# Altium project engine-control-unit.PrjPcb
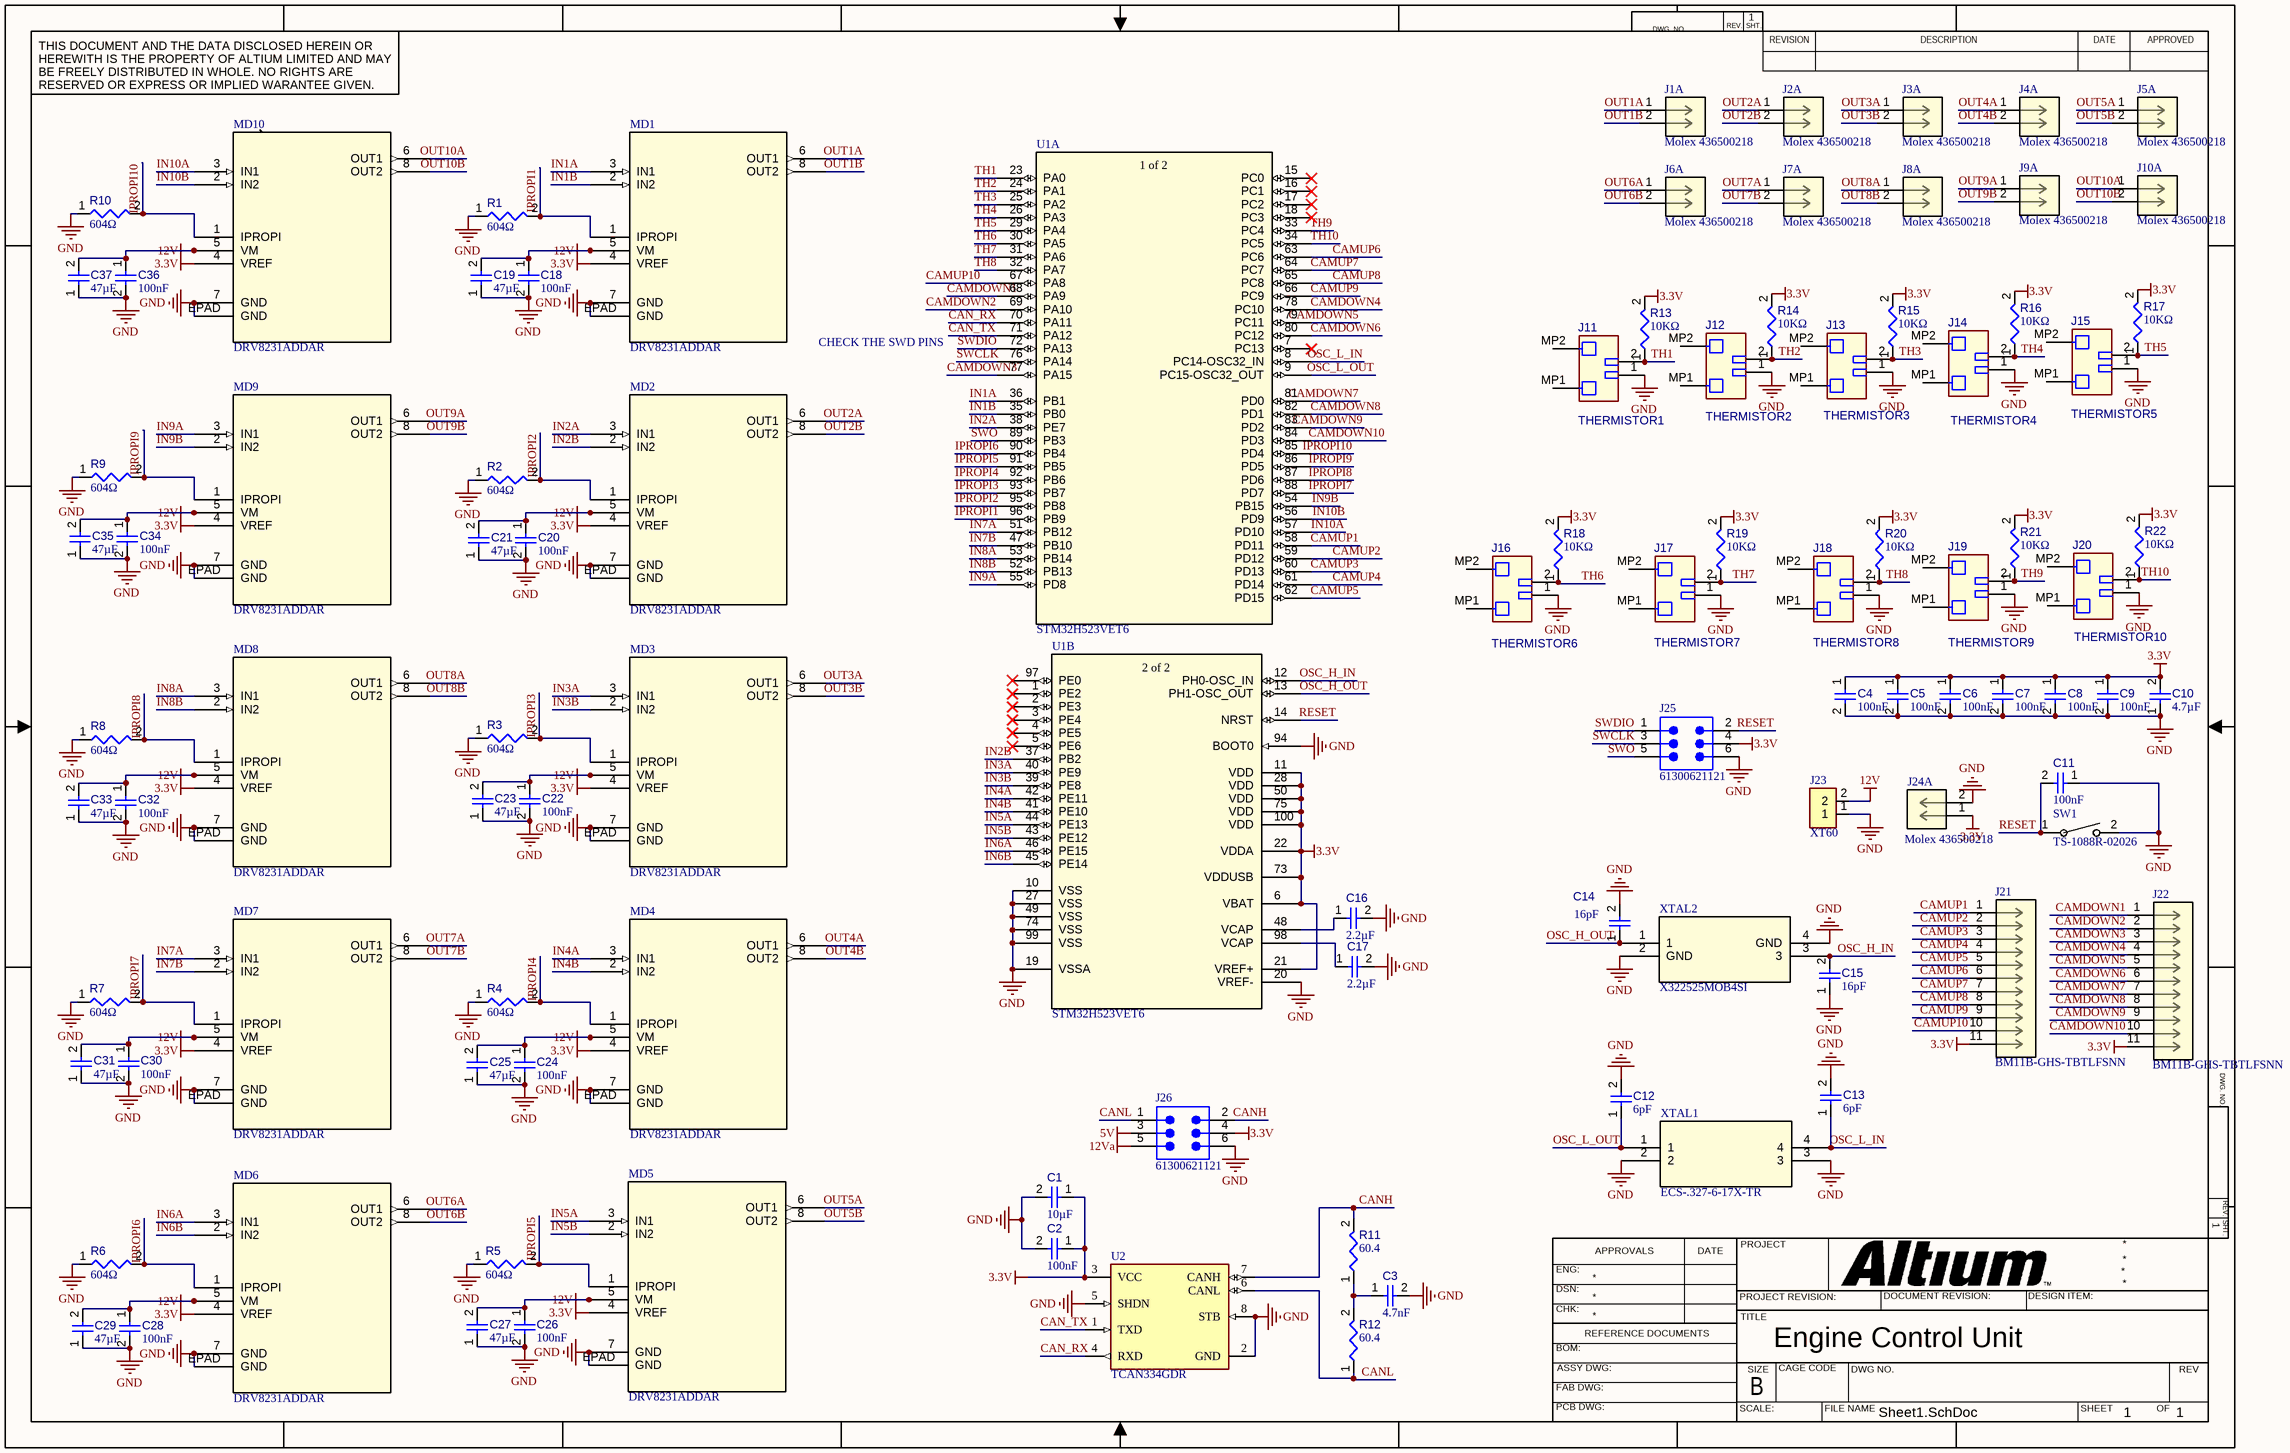
[diagram p0: Sheet1.SchDoc]
1 sheet, 100 parts. Net scope: global (net labels, ports and power ports of the same name join across sheets).
Board file: PCB1.PcbDoc

## Sheet Sheet1.SchDoc: Engine Control Unit
size 431 x 279 mm; Date: June 27, 2025; Author: Jaylen Cheung; Revision: A; SheetNumber: 1; SheetTotal: 1

### Parts
C1  value 10µF  [CAPC0805(2012)145_L]  (hidden comment: Capacitor 10µF +/-20% 25V 0805)
C2  value 100nF  [CAPC0402(1005)60_L]  (hidden comment: Capacitor 100nF +/-20% 50V 0402)
C3  value 4.7nF  [CAPC1709X04N]  (hidden comment: yageo CC0603KRX7R9BB472)
C4  value 100nF  [CAPC0402(1005)60_L]  (hidden comment: Capacitor 100nF +/-20% 50V 0402)
C5  value 100nF  [CAPC0402(1005)60_L]  (hidden comment: Capacitor 100nF +/-20% 50V 0402)
C6  value 100nF  [CAPC0402(1005)60_L]  (hidden comment: Capacitor 100nF +/-20% 50V 0402)
C7  value 100nF  [CAPC0402(1005)60_L]  (hidden comment: Capacitor 100nF +/-20% 50V 0402)
C8  value 100nF  [CAPC0402(1005)60_L]  (hidden comment: Capacitor 100nF +/-20% 50V 0402)
C9  value 100nF  [CAPC0402(1005)60_L]  (hidden comment: Capacitor 100nF +/-20% 50V 0402)
C10  value 4.7µF  [CAPC0603(1608)100_L]  (hidden comment: Capacitor 4.7µF +/-20% 10V 0603)
C11  value 100nF  [CAPC0402(1005)60_L]  (hidden comment: Capacitor 100nF +/-20% 50V 0402)
C12  value 6pF  [CAPC1709X04N]  (hidden comment: Yageo CC0603CRNPO9BN6R0)
C13  value 6pF  [CAPC1709X04N]  (hidden comment: Yageo CC0603CRNPO9BN6R0)
C14  value 16pF  [CAPC1709X04N]  (hidden comment: Yageo CC0603JRNPO9BN160)
C15  value 16pF  [CAPC1709X04N]  (hidden comment: Yageo CC0603JRNPO9BN160)
C16  value 2.2µF  [CAPC1709X04N]  (hidden comment: yageo CC0603KRX5R8BB225)
C17  value 2.2µF  [CAPC1709X04N]  (hidden comment: yageo CC0603KRX5R8BB225)
C18  value 100nF  [CAPC0402(1005)60_L]  (hidden comment: Capacitor 100nF +/-20% 50V 0402)
C19  value 47µF  [N18F1D473MQ0T0S0N0-Footprint-1]  (hidden comment: N18F1D473MQ0T0S0N0)
C20  value 100nF  [CAPC0402(1005)60_L]  (hidden comment: Capacitor 100nF +/-20% 50V 0402)
C21  value 47µF  [N18F1D473MQ0T0S0N0-Footprint-1]  (hidden comment: N18F1D473MQ0T0S0N0)
C22  value 100nF  [CAPC0402(1005)60_L]  (hidden comment: Capacitor 100nF +/-20% 50V 0402)
C23  value 47µF  [N18F1D473MQ0T0S0N0-Footprint-1]  (hidden comment: N18F1D473MQ0T0S0N0)
C24  value 100nF  [CAPC0402(1005)60_L]  (hidden comment: Capacitor 100nF +/-20% 50V 0402)
C25  value 47µF  [N18F1D473MQ0T0S0N0-Footprint-1]  (hidden comment: N18F1D473MQ0T0S0N0)
C26  value 100nF  [CAPC0402(1005)60_L]  (hidden comment: Capacitor 100nF +/-20% 50V 0402)
C27  value 47µF  [N18F1D473MQ0T0S0N0-Footprint-1]  (hidden comment: N18F1D473MQ0T0S0N0)
C28  value 100nF  [CAPC0402(1005)60_L]  (hidden comment: Capacitor 100nF +/-20% 50V 0402)
C29  value 47µF  [N18F1D473MQ0T0S0N0-Footprint-1]  (hidden comment: N18F1D473MQ0T0S0N0)
C30  value 100nF  [CAPC0402(1005)60_L]  (hidden comment: Capacitor 100nF +/-20% 50V 0402)
C31  value 47µF  [N18F1D473MQ0T0S0N0-Footprint-1]  (hidden comment: N18F1D473MQ0T0S0N0)
C32  value 100nF  [CAPC0402(1005)60_L]  (hidden comment: Capacitor 100nF +/-20% 50V 0402)
C33  value 47µF  [N18F1D473MQ0T0S0N0-Footprint-1]  (hidden comment: N18F1D473MQ0T0S0N0)
C34  value 100nF  [CAPC0402(1005)60_L]  (hidden comment: Capacitor 100nF +/-20% 50V 0402)
C35  value 47µF  [N18F1D473MQ0T0S0N0-Footprint-1]  (hidden comment: N18F1D473MQ0T0S0N0)
C36  value 100nF  [CAPC0402(1005)60_L]  (hidden comment: Capacitor 100nF +/-20% 50V 0402)
C37  value 47µF  [N18F1D473MQ0T0S0N0-Footprint-1]  (hidden comment: N18F1D473MQ0T0S0N0)
J1  Molex 436500218  [CONN_SD-43650-007_02_MOL]  (part A of 2)
J2  Molex 436500218  [CONN_SD-43650-007_02_MOL]  (part A of 2)
J3  Molex 436500218  [CONN_SD-43650-007_02_MOL]  (part A of 2)
J4  Molex 436500218  [CONN_SD-43650-007_02_MOL]  (part A of 2)
J5  Molex 436500218  [CONN_SD-43650-007_02_MOL]  (part A of 2)
J6  Molex 436500218  [CONN_SD-43650-007_02_MOL]  (part A of 2)
J7  Molex 436500218  [CONN_SD-43650-007_02_MOL]  (part A of 2)
J8  Molex 436500218  [CONN_SD-43650-007_02_MOL]  (part A of 2)
J9  Molex 436500218  [CONN_SD-43650-007_02_MOL]  (part A of 2)
J10  Molex 436500218  [CONN_SD-43650-007_02_MOL]  (part A of 2)
J11  THERMISTOR1  [JST-BM02B-GHS-TBT_V]
J12  THERMISTOR2  [JST-BM02B-GHS-TBT_V]
J13  THERMISTOR3  [JST-BM02B-GHS-TBT_V]
J14  THERMISTOR4  [JST-BM02B-GHS-TBT_V]
J15  THERMISTOR5  [JST-BM02B-GHS-TBT_V]
J16  THERMISTOR6  [JST-BM02B-GHS-TBT_V]
J17  THERMISTOR7  [JST-BM02B-GHS-TBT_V]
J18  THERMISTOR8  [JST-BM02B-GHS-TBT_V]
J19  THERMISTOR9  [JST-BM02B-GHS-TBT_V]
J20  THERMISTOR10  [JST-BM02B-GHS-TBT_V]
J21  BM11B-GHS-TBTLFSNN  [CONN11_BM11B-GHS-TBTLFSNN_JST]
J22  BM11B-GHS-TBTLFSNN  [CONN11_BM11B-GHS-TBTLFSNN_JST]
J23  XT60  [AMASS_XT60PB-M]
J24  Molex 436500218  [CONN_SD-43650-007_02_MOL]  (part A of 2)
J25  61300621121  [61300621121]
J26  61300621121  [61300621121]
MD1  DRV8231ADDAR  [SOIC-8-DDA-DRV8231_TEX]
MD2  DRV8231ADDAR  [SOIC-8-DDA-DRV8231_TEX]
MD3  DRV8231ADDAR  [SOIC-8-DDA-DRV8231_TEX]
MD4  DRV8231ADDAR  [SOIC-8-DDA-DRV8231_TEX]
MD5  DRV8231ADDAR  [SOIC-8-DDA-DRV8231_TEX]
MD6  DRV8231ADDAR  [SOIC-8-DDA-DRV8231_TEX]
MD7  DRV8231ADDAR  [SOIC-8-DDA-DRV8231_TEX]
MD8  DRV8231ADDAR  [SOIC-8-DDA-DRV8231_TEX]
MD9  DRV8231ADDAR  [SOIC-8-DDA-DRV8231_TEX]
MD10  DRV8231ADDAR  [SOIC-8-DDA-DRV8231_TEX]
R1  value 604Ω  [RESC2013X50X35ML15T15]  (hidden comment: Resistor 10k +/-1% 0805 125 mW)
R2  value 604Ω  [RESC2013X50X35ML15T15]  (hidden comment: Resistor 10k +/-1% 0805 125 mW)
R3  value 604Ω  [RESC2013X50X35ML15T15]  (hidden comment: Resistor 10k +/-1% 0805 125 mW)
R4  value 604Ω  [RESC2013X50X35ML15T15]  (hidden comment: Resistor 10k +/-1% 0805 125 mW)
R5  value 604Ω  [RESC2013X50X35ML15T15]  (hidden comment: Resistor 10k +/-1% 0805 125 mW)
R6  value 604Ω  [RESC2013X50X35ML15T15]  (hidden comment: Resistor 10k +/-1% 0805 125 mW)
R7  value 604Ω  [RESC2013X50X35ML15T15]  (hidden comment: Resistor 10k +/-1% 0805 125 mW)
R8  value 604Ω  [RESC2013X50X35ML15T15]  (hidden comment: Resistor 10k +/-1% 0805 125 mW)
R9  value 604Ω  [RESC2013X50X35ML15T15]  (hidden comment: Resistor 10k +/-1% 0805 125 mW)
R10  value 604Ω  [RESC2013X50X35ML15T15]  (hidden comment: Resistor 10k +/-1% 0805 125 mW)
R11  value 60.4  [RESC1709X04N]  (hidden comment: yageo RC0603FR-0760R4L)
R12  value 60.4  [RESC1709X04N]  (hidden comment: yageo RC0603FR-0760R4L)
R13  value 10KΩ  [RESC0402(1005)_L]  (hidden comment: 10R2F)
R14  value 10KΩ  [RESC0402(1005)_L]  (hidden comment: 10R2F)
R15  value 10KΩ  [RESC0402(1005)_L]  (hidden comment: 10R2F)
R16  value 10KΩ  [RESC0402(1005)_L]  (hidden comment: 10R2F)
R17  value 10KΩ  [RESC0402(1005)_L]  (hidden comment: 10R2F)
R18  value 10KΩ  [RESC0402(1005)_L]  (hidden comment: 10R2F)
R19  value 10KΩ  [RESC0402(1005)_L]  (hidden comment: 10R2F)
R20  value 10KΩ  [RESC0402(1005)_L]  (hidden comment: 10R2F)
R21  value 10KΩ  [RESC0402(1005)_L]  (hidden comment: 10R2F)
R22  value 10KΩ  [RESC0402(1005)_L]  (hidden comment: 10R2F)
SW1  TS-1088R-02026  [SW_TS-1088R-02026_XNP]
U1  STM32H523VET6  [LQFP-100]  (parts A,B of 2)
U2  TCAN334GDR  [FP-D0008A-IPC_B]
XTAL1  ECS-.327-6-17X-TR  [XTAL_7X-TR_ECS]
XTAL2  X322525MOB4SI  [SMT_MOB4SI_YXC]

### Nets
3.3V: C1.1 C2.1 C4.1 C5.1 C6.1 C7.1 C8.1 C9.1 C10.2 J21.11 J22.11 J24.1 J25.4 J26.4 MD1.4(VREF) MD2.4(VREF) MD3.4(VREF) MD4.4(VREF) MD5.4(VREF) MD6.4(VREF) MD7.4(VREF) MD8.4(VREF) MD9.4(VREF) MD10.4(VREF) R13.2 R14.2 R15.2 R16.2 R17.2 R18.2 R19.2 R20.2 R21.2 R22.2 U1.6(VBAT) U1.11(VDD) U1.21(VREF+) U1.22(VDDA) U1.28(VDD) U1.50(VDD) U1.73(VDDUSB) U1.75(VDD) U1.100(VDD) U2.3(VCC)
5V: J26.3
12V: C18.1 C19.2 C20.1 C21.2 C22.1 C23.2 C24.1 C25.2 C26.1 C27.2 C28.1 C29.2 C30.1 C31.2 C32.1 C33.2 C34.1 C35.2 C36.1 C37.2 J23.2 MD1.5(VM) MD2.5(VM) MD3.5(VM) MD4.5(VM) MD5.5(VM) MD6.5(VM) MD7.5(VM) MD8.5(VM) MD9.5(VM) MD10.5(VM)
12Va: J26.5
GND: C1.2 C2.2 C3.2 C4.2 C5.2 C6.2 C7.2 C8.2 C9.2 C10.1 C11.1 C12.2 C13.2 C14.2 C15.1 C16.2 C17.2 C18.2 C19.1 C20.2 C21.1 C22.2 C23.1 C24.2 C25.1 C26.2 C27.1 C28.2 C29.1 C30.2 C31.1 C32.2 C33.1 C34.2 C35.1 C36.2 C37.1 J11.1 J12.1 J13.1 J14.1 J15.1 J16.1 J17.1 J18.1 J19.1 J20.1 J23.1 J24.2 J25.6 J26.6 MD1.7(GND) MD1.EPAD(GND) MD2.7(GND) MD2.EPAD(GND) MD3.7(GND) MD3.EPAD(GND) MD4.7(GND) MD4.EPAD(GND) MD5.7(GND) MD5.EPAD(GND) MD6.7(GND) MD6.EPAD(GND) MD7.7(GND) MD7.EPAD(GND) MD8.7(GND) MD8.EPAD(GND) MD9.7(GND) MD9.EPAD(GND) MD10.7(GND) MD10.EPAD(GND) R1.1 R2.1 R3.1 R4.1 R5.1 R6.1 R7.1 R8.1 R9.1 R10.1 SW1.2 U1.10(VSS) U1.19(VSSA) U1.20(VREF-) U1.27(VSS) U1.49(VSS) U1.74(VSS) U1.94(BOOT0) U1.99(VSS) U2.2(GND) U2.5(SHDN) U2.8(STB) XTAL1.2 XTAL1.3 XTAL2.2(GND) XTAL2.4(GND)
CAMDOWN1: J22.1 U1.68(PA9)
CAMDOWN2: J22.2 U1.69(PA10)
CAMDOWN3: J22.3 U1.77(PA15)
CAMDOWN4: J22.4 U1.78(PC10)
CAMDOWN5: J22.5 U1.79(PC11)
CAMDOWN6: J22.6 U1.80(PC12)
CAMDOWN7: J22.7 U1.81(PD0)
CAMDOWN8: J22.8 U1.82(PD1)
CAMDOWN9: J22.9 U1.83(PD2)
CAMDOWN10: J22.10 U1.84(PD3)
CAMUP1: J21.1 U1.58(PD11)
CAMUP2: J21.2 U1.59(PD12)
CAMUP3: J21.3 U1.60(PD13)
CAMUP4: J21.4 U1.61(PD14)
CAMUP5: J21.5 U1.62(PD15)
CAMUP6: J21.6 U1.63(PC6)
CAMUP7: J21.7 U1.64(PC7)
CAMUP8: J21.8 U1.65(PC8)
CAMUP9: J21.9 U1.66(PC9)
CAMUP10: J21.10 U1.67(PA8)
CAN_RX: U1.70(PA11) U2.4(RXD)
CAN_TX: U1.71(PA12) U2.1(TXD)
CANH: J26.2 R11.2 U2.7(CANH)
CANL: J26.1 R12.1 U2.6(CANL)
IN1A: MD1.3(IN1) U1.36(PB1)
IN1B: MD1.2(IN2) U1.35(PB0)
IN2A: MD2.3(IN1) U1.38(PE7)
IN2B: MD2.2(IN2) U1.37(PB2)
IN3A: MD3.3(IN1) U1.40(PE9)
IN3B: MD3.2(IN2) U1.39(PE8)
IN4A: MD4.3(IN1) U1.42(PE11)
IN4B: MD4.2(IN2) U1.41(PE10)
IN5A: MD5.3(IN1) U1.44(PE13)
IN5B: MD5.2(IN2) U1.43(PE12)
IN6A: MD6.3(IN1) U1.46(PE15)
IN6B: MD6.2(IN2) U1.45(PE14)
IN7A: MD7.3(IN1) U1.51(PB12)
IN7B: MD7.2(IN2) U1.47(PB10)
IN8A: MD8.3(IN1) U1.53(PB14)
IN8B: MD8.2(IN2) U1.52(PB13)
IN9A: MD9.3(IN1) U1.55(PD8)
IN9B: MD9.2(IN2) U1.54(PB15)
IN10A: MD10.3(IN1) U1.57(PD10)
IN10B: MD10.2(IN2) U1.56(PD9)
IPROPI1: MD1.1(IPROPI) R1.2 U1.96(PB9)
IPROPI2: MD2.1(IPROPI) R2.2 U1.95(PB8)
IPROPI3: MD3.1(IPROPI) R3.2 U1.93(PB7)
IPROPI4: MD4.1(IPROPI) R4.2 U1.92(PB6)
IPROPI5: MD5.1(IPROPI) R5.2 U1.91(PB5)
IPROPI6: MD6.1(IPROPI) R6.2 U1.90(PB4)
IPROPI7: MD7.1(IPROPI) R7.2 U1.88(PD7)
IPROPI8: MD8.1(IPROPI) R8.2 U1.87(PD6)
IPROPI9: MD9.1(IPROPI) R9.2 U1.86(PD5)
IPROPI10: MD10.1(IPROPI) R10.2 U1.85(PD4)
OSC_H_IN: C15.2 U1.12(PH0-OSC_IN) XTAL2.3
OSC_H_OUT: C14.1 U1.13(PH1-OSC_OUT) XTAL2.1
OSC_L_IN: C13.1 U1.8(PC14-OSC32_IN) XTAL1.4
OSC_L_OUT: C12.1 U1.9(PC15-OSC32_OUT) XTAL1.1
OUT1A: J1.1 MD1.6(OUT1)
OUT1B: J1.2 MD1.8(OUT2)
OUT2A: J2.1 MD2.6(OUT1)
OUT2B: J2.2 MD2.8(OUT2)
OUT3A: J3.1 MD3.6(OUT1)
OUT3B: J3.2 MD3.8(OUT2)
OUT4A: J4.1 MD4.6(OUT1)
OUT4B: J4.2 MD4.8(OUT2)
OUT5A: J5.1 MD5.6(OUT1)
OUT5B: J5.2 MD5.8(OUT2)
OUT6A: J6.1 MD6.6(OUT1)
OUT6B: J6.2 MD6.8(OUT2)
OUT7A: J7.1 MD7.6(OUT1)
OUT7B: J7.2 MD7.8(OUT2)
OUT8A: J8.1 MD8.6(OUT1)
OUT8B: J8.2 MD8.8(OUT2)
OUT9A: J9.1 MD9.6(OUT1)
OUT9B: J9.2 MD9.8(OUT2)
OUT10A: J10.1 MD10.6(OUT1)
OUT10B: J10.2 MD10.8(OUT2)
RESET: C11.2 J25.2 SW1.1 U1.14(NRST)
SWCLK: J25.3 U1.76(PA14)
SWDIO: J25.1 U1.72(PA13)
SWO: J25.5 U1.89(PB3)
TH1: J11.2 R13.1 U1.23(PA0)
TH2: J12.2 R14.1 U1.24(PA1)
TH3: J13.2 R15.1 U1.25(PA2)
TH4: J14.2 R16.1 U1.26(PA3)
TH5: J15.2 R17.1 U1.29(PA4)
TH6: J16.2 R18.1 U1.30(PA5)
TH7: J17.2 R19.1 U1.31(PA6)
TH8: J18.2 R20.1 U1.32(PA7)
TH9: J19.2 R21.1 U1.33(PC4)
TH10: J20.2 R22.1 U1.34(PC5)
NetC3_1: C3.1 R11.1 R12.2
NetC16_1: C16.1 U1.48(VCAP)
NetC17_1: C17.1 U1.98(VCAP)

Not connected (* = marked no-connect by the designer): J11 MP1 MP2; J12 MP1 MP2; J13 MP1 MP2; J14 MP1 MP2; J15 MP1 MP2; J16 MP1 MP2; J17 MP1 MP2; J18 MP1 MP2; J19 MP1 MP2; J20 MP1 MP2; U1 1(PE2)* 2(PE3)* 3(PE4)* 4(PE5)* 5(PE6)* 7(PC13)* 15(PC0)* 16(PC1)* 17(PC2)* 18(PC3)* 97(PE0)*

### Notes on the sheet
- (near MD1) CHECK THE SWD PINS
- DWG. NO.
- REV.
- SHT.
- THIS DOCUMENT AND THE DATA DISCLOSED HEREIN OR HEREWITH IS THE PROPERTY OF ALTIUM LIMITED AND MAY BE FREELY DISTRIBUTED IN WHOLE. NO RIGHTS ARE RESERVED OR EXPRESS OR IMPLIED WARANTEE GIVEN.
- REVISION
- DESCRIPTION
- DATE
- APPROVED
- ENG:
- APPROVALS
- PROJECT
- DSN:
- CHK:
- REFERENCE DOCUMENTS
- PROJECT REVISION:
- TITLE
- DOCUMENT REVISION:
- DESIGN ITEM:
- BOM:
- FAB DWG:
- PCB DWG:
- ASSY DWG:
- SCALE:
- SIZE
- B
- CAGE CODE
- FILE NAME
- DWG NO.
- SHEET
- OF
- REV
- (in symbol CMP-006-000002-1, part A) 1 of 2
- (in symbol CMP-006-000002-1, part B) 2 of 2

### Library data of the parts
C1 = CMP-001-00079-4: Chip Capacitor, 10µF +/-20%, 25V, 0805, Thickness 1.45 mm; Tolerance: 10%; Max Operating Temperature: 85°C; Case/Package: 0805; Voltage Rating: 25V; Min Operating Temperature: -55°C; Mounting Technology: SMT; Pins: 2
C2 C4-C9 C11 C18 C20 C22 C24 C26 C28 C30 C32 C34 C36 = CMP-001-00067-3: Chip Capacitor, 100nF +/-20%, 50V, 0402, Thickness 0.6 mm; Tolerance: 10%; Min Operating Temperature: -55°C; Pins: 2; Case/Package: 0402; Max Operating Temperature: 85°C; Voltage Rating: 50V; Mounting Technology: SMT
C3 = CMP-001-00083-3: Ceramic Capacitor, Multilayer, Ceramic, 50V, 10% +Tol, 10% -Tol, X7R, 15% TC, 0.0047uF, Surface Mount, 0603; Max Operating Temperature: 125°C; RoHS Compliant: Yes; Case/Package: 0603; Mounting Technology: Surface Mount; Pins: 2; Capacitor Type: Ceramic; Min Operating Temperature: -55°C
C10 = CMP-001-00076-4: Chip Capacitor, 4.7µF +/-20%, 10V, 0603, Thickness 1 mm; Tolerance: 10%; Mounting Technology: SMT; Case/Package: 0603; Pins: 2; Min Operating Temperature: -55°C; Max Operating Temperature: 85°C; Voltage Rating: 10V
C12 C13 = CMP-001-00085-2: Ceramic Capacitor, Multilayer, Ceramic, 50V, 4.17% +Tol, 4.17% -Tol, C0G, -/+30ppm/Cel TC, 0.000006uF, Surface Mount, 0603; Pins: 2; Capacitor Type: Ceramic; Case/Package: 0603; Mounting Technology: Surface Mount; RoHS Compliant: Yes; Min Operating Temperature: -55°C; Max Operating Temperature: 125°C
C14 C15 = CMP-001-00087-3: Multilayer Ceramic Capacitor, 16 pF, 50 V, ± 5%, C0G (NP0), 0603 [1608 Metric]
C16 C17 = CMP-001-00088-2: Ceramic Capacitor, Multilayer, Ceramic, 25V, 10% +Tol, 10% -Tol, X5R, 15% TC, 2.2uF, Surface Mount, 0603; Case/Package: 0603; Pins: 2; Min Operating Temperature: -55°C; RoHS Compliant: Yes; Capacitor Type: Ceramic; Max Operating Temperature: 85°C; Mounting Technology: Surface Mount
C19 C21 C23 C25 C27 C29 C31 C33 C35 C37 = CMP-001-00089-5: ±20% 47nF Y5V 1kV Plugin, P=10mm Through Hole Ceramic Capacitors ROHS
J1-J10 J24 = CMP-014-000000-7: No Description Available; Mfr_Name: Molex Connector Corporation; Design Item ID: 436500218; RefDes: RefDes; Source: 436500218.SchLib; Type: Type
J11-J20 = CMP-002-00061-3: Disconnectable Crimp Style Connector, Pitch 1.25 mm, 1 x 2 Position, Height 4.05 mm, -25 to 85 degC, RoHS, Tape and Reel; Connector Type: Header,Shrouded; Mounting Technology: SurfaceMount; Case/Package: Disconnectable Crimp Style Connector, Pitch 1.25 mm, 1 x 2 Position, Height 4.05 mm; Pins: 4
J21 J22 = CMP-168-000000-2: No Description Available; Manufacturer_Part_Number: BM11B-GHS-TBT(LF)(SN)(N); Manufacturer_Name: JST; RefDes: RefDes; Copyright: Copyright (C) 2025 Ultra Librarian. All rights reserved.; Design Item ID: BM11B-GHS-TBTLFSNN; Source: BM11B-GHS-TBTLFSNN.SchLib; Type: Type
J23 = CMP-011-000000-3: Power connector; 65A; PIN: 2; Colour: yellow; MF: Pololu; MP: XT60 YELLOW; Package: None; Availability: Not in stock; Check_prices: https://www.snapeda.com/parts/XT60%20YELLOW/Pololu/view-part/?ref=eda; Source: XT60_YELLOW.SchLib; Component Type: Standard; Value: *; SnapEDA_Link: https://www.snapeda.com/parts/XT60%20YELLOW/Pololu/view-part/?ref=snap; Price: None; Pin Count: 2; Design Item ID: XT60_YELLOW
J25 J26 = CMP-002-00076-2: WR-PHD Pin Header, THT, Vertical, pitch 2.54mm, 2 Row, 6P; Manufacturer: Wurth Elektronik; Contact Resistance: 20mOhm; Withstanding Voltage: 500V; Working Voltage: 250V; Rated Current: 3A; ComponentLink2URL: https://www.we-online.com/redexpert/spec/61300621121?ad; Operating Temperature Max: 105°C; Operating Temperature Min: -40°C; Match Code: WR-PHD; Pins: 6; Source: WR-PHD.SchLib; ComponentLink1URL: https://www.we-online.com/redexpert/article/61300621121?ad; Mount: Through Hole; Design Item ID: 61300621121; Orientation: Vertical; Manufacturer Part Number: 61300621121; Category: Board-to-Board Connectors; Pitch: 2.54mm; ComponentLink2Description: Datasheet Link; Packaging: Bag; Gender: Pin Header; ComponentLink1Description: Website Link; Pin Count: 6; Component Type: Standard; Number of Rows: 2
MD1-MD10 = CMP-003-000001-2: No Description Available; Mfr_Name: Texas Instruments; Source: DRV8231ADDAR.SchLib; Pin Count: 9; RefDes: abcdef; Type: Type; Design Item ID: DRV8231ADDAR; Component Type: Standard
R1-R10 = CMP-009-00018-5: Chip Resistor, 10 KOhm, +/- 1%, 125 mW, -55 to 155 degC, 0805 (2012 Metric); Power: 125mW; Voltage Rating: 150V; Tolerance: 1%; Pins: 2; Min Operating Temperature: -55°C; Case/Package: 0805; Max Operating Temperature: 155°C; RoHS Compliant: True; Mounting Technology: SM
R11 R12 = CMP-009-00177-3: Fixed Resistor, Metal Glaze/thick Film, 0.1W, 60.4ohm, 75V, 1% +/-Tol, 100ppm/Cel, Surface Mount, 0603; Power: 100mW; Max Operating Temperature: 155°C; Pins: 2; Tolerance: 1%; RoHS Compliant: Yes; Min Operating Temperature: -55°C; Mounting Technology: Surface Mount; Case/Package: 0603
R13-R22 = CMP-009-00067-2: 10R 0.063W 1% 0402 (1005 Metric)  SMD; Power: 63mW; Case/Package: 0402; Tolerance: 1%; Mounting Technology: SMT; Pins: 2
SW1 = CMP-011-00013-2: No Description Available; Manufacturer_Name: Xunpu; Design Item ID: TS-1088R-02026; Copyright: Copyright (C) 2025 Ultra Librarian. All rights reserved.; Manufacturer_Part_Number: TS-1088R-02026; Type: Tactile Switches; Source: TS-1088R-02026.SchLib
U1 = CMP-006-000002-1: No Description Available; Mfr_Name: STMicroelectronics; RefDes: RefDes; Type: Type; Design Item ID: STM32H523VET6; Source: STM32H523VET6.SchLib
U2 = CMP-015-00009-1: Interface Circuit, PDSO8; Nominal Supply Voltage: 3.3V; Min Operating Temperature: -40°C; RoHS Compliant: Yes; Max Operating Temperature: 125°C; Pins: 8; Case/Package: SOP
XTAL1 = CMP-036-000000-1: No Description Available; Manufacturer_Name: ECS International; Copyright: Copyright (C) 2025 Ultra Librarian. All rights reserved.; Manufacturer_Part_Number: ECS-.327-6-17X-TR; Design Item ID: ECS-.327-6-17X-TR; Source: ECS-P327-6-17X-TR.SchLib; RefDes: RefDes; Type: Type
XTAL2 = CMP-039-000000-5: No Description Available; Manufacturer_Name: YXC; Frequency: 25MHz; Design Item ID: X322525MOB4SI; Copyright: Copyright (C) 2025 Ultra Librarian. All rights reserved.; Source: X322525MOB4SI.SchLib; Type: Type; RefDes: RefDes; Manufacturer_Part_Number: X322525MOB4SI